# Altium schematic sheet RS485_block.SchDoc
size 635 x 381 mm; SheetNumber: 5; SheetTotal: 8
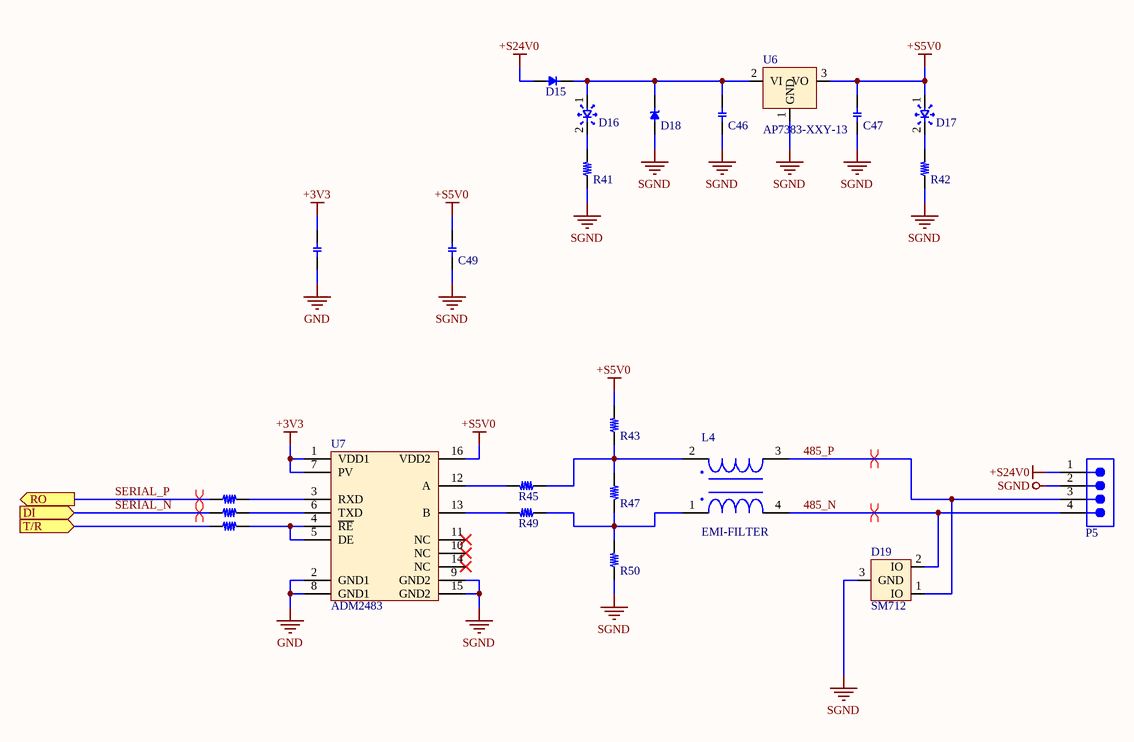
[diagram p0: RS485_block.SchDoc]

## Parts
C46  CAP_SMD  [C 0603]  (value not drawn)
C47  CAP_SMD  [C 0603]  (value not drawn)
C48  CAP_SMD  [C 0603]  (value not drawn)
C49  CAP_SMD  [C 0603]  (value not drawn)
D15  DIOD_SMD  [DIOD_SMA]  (value not drawn)
D16  LED_SMD  [D 0603]  (value not drawn)
D17  LED_SMD  [D 0603]  (value not drawn)
D18  TVS_UI  [DIOD_SMB]  (value not drawn)
D19  SM712  [SOT-23_3_D]
L4  EMI-FILTER  [EMI-FILTER-1206]
P5  691321300004  [691321300004]  (value not drawn)
R41  RES_SMD  [R 0603]  (value not drawn)
R42  RES_SMD  [R 0603]  (value not drawn)
R43  RES_SMD  [R 1206]  (value not drawn)
R44  RES_SMD  [R 0603]  (value not drawn)
R45  RES_SMD  [R 1206]  (value not drawn)
R46  RES_SMD  [R 0603]  (value not drawn)
R47  RES_SMD  [R 1206]  (value not drawn)
R48  RES_SMD  [R 0603]  (value not drawn)
R49  RES_SMD  [R 1206]  (value not drawn)
R50  RES_SMD  [R 1206]  (value not drawn)
U6  AP7383-XXY-13  [SOT89-U]
U7  ADM2483  [SOIC-16-WIDE]

## Ports
DI (in), RO (out), T/R (in)

## Nets
+3V3: C48.2 U7.1(VDD1) U7.7(PV)
+S5V0: C47.2 C49.2 D17.1 R43.2 U6.3(VO) U7.16(VDD2)
+S24V0: D15.1 P5.1
GND: C48.1 U7.2(GND1) U7.8(GND1)
SGND: C46.1 C47.1 C49.1 D18.1 D19.3(GND) P5.2 R41.1 R42.1 R50.1 U6.1(GND) U7.9(GND2) U7.15(GND2)
485_N: D19.2(IO) L4.4 P5.4
485_P: D19.1(IO) L4.3 P5.3
SERIAL_N: R46.1 ; port DI
SERIAL_P: R44.1 ; port RO
T/R: R48.1 ; port T/R
NetC46_2: C46.2 D15.2 D16.1 D18.2 U6.2(VI)
NetD16_2: D16.2 R41.2
NetD17_2: D17.2 R42.2
NetL4_1: L4.1 R47.2 R49.1 R50.2
NetL4_2: L4.2 R43.1 R45.1 R47.1
NetR44_2: R44.2 U7.3(RXD)
NetR45_2: R45.2 U7.12(A)
NetR46_2: R46.2 U7.6(TXD)
NetR48_2: R48.2 U7.4(~{RE}) U7.5(DE)
NetR49_2: R49.2 U7.13(B)

Not connected (* = marked no-connect by the designer): U7 10(NC)* 11(NC)* 14(NC)*

## Layout directives
differential pair: 485_N, 485_P, SERIAL_N, SERIAL_P

## Library data of the parts
D18 = DIOD_SMD_TVS_UI
P5 = 691321300004: WR-TBL Series 321 Vertical PCB Header, Through Hole, pitch 3.81mm, 4p; Manufacturer: Wurth Elektronik; Pin Number: 4; Rated Current: 10A; Working Voltage: 300V; Modularity: No; ComponentLink1Description: Manufacturer Link; ComponentLink1URL: https://www.we-online.com/redexpert/article/691321300004?ad; ComponentLink2Description: Datasheet; ComponentLink2URL: https://www.we-online.com/redexpert/spec/691321300004?ad; Category: Terminal Blocks; Match Code: WR-TBL; Manufacturer Part Number: 691321300004; Mount: Through Hole; Operating Temperature Max: 105°C; Operating Temperature Min: -40°C; Packaging: Box; Pitch: 3.81mm; Orientation: Vertical; Application: Pluggable; PCB/Cable/Panel: PCB